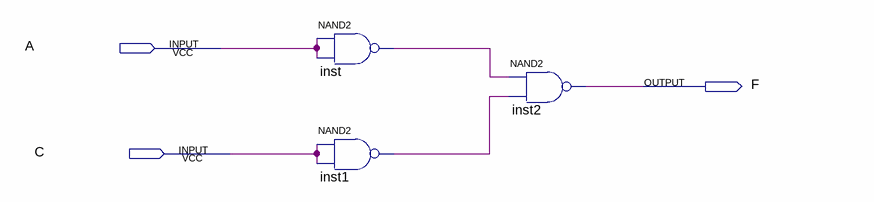
[diagram p0: schematic sheet]
// Quartus schematic Exercise1Question2.bdf as structural Verilog: 3 symbols, 3 pins
module Exercise1Question2 (
  input  A,
  input  C,
  output F
);

  wire inst1_out, inst_out;

  nand inst (inst_out, A, A);
  nand inst1 (inst1_out, C, C);
  nand inst2 (F, inst_out, inst1_out);
endmodule
